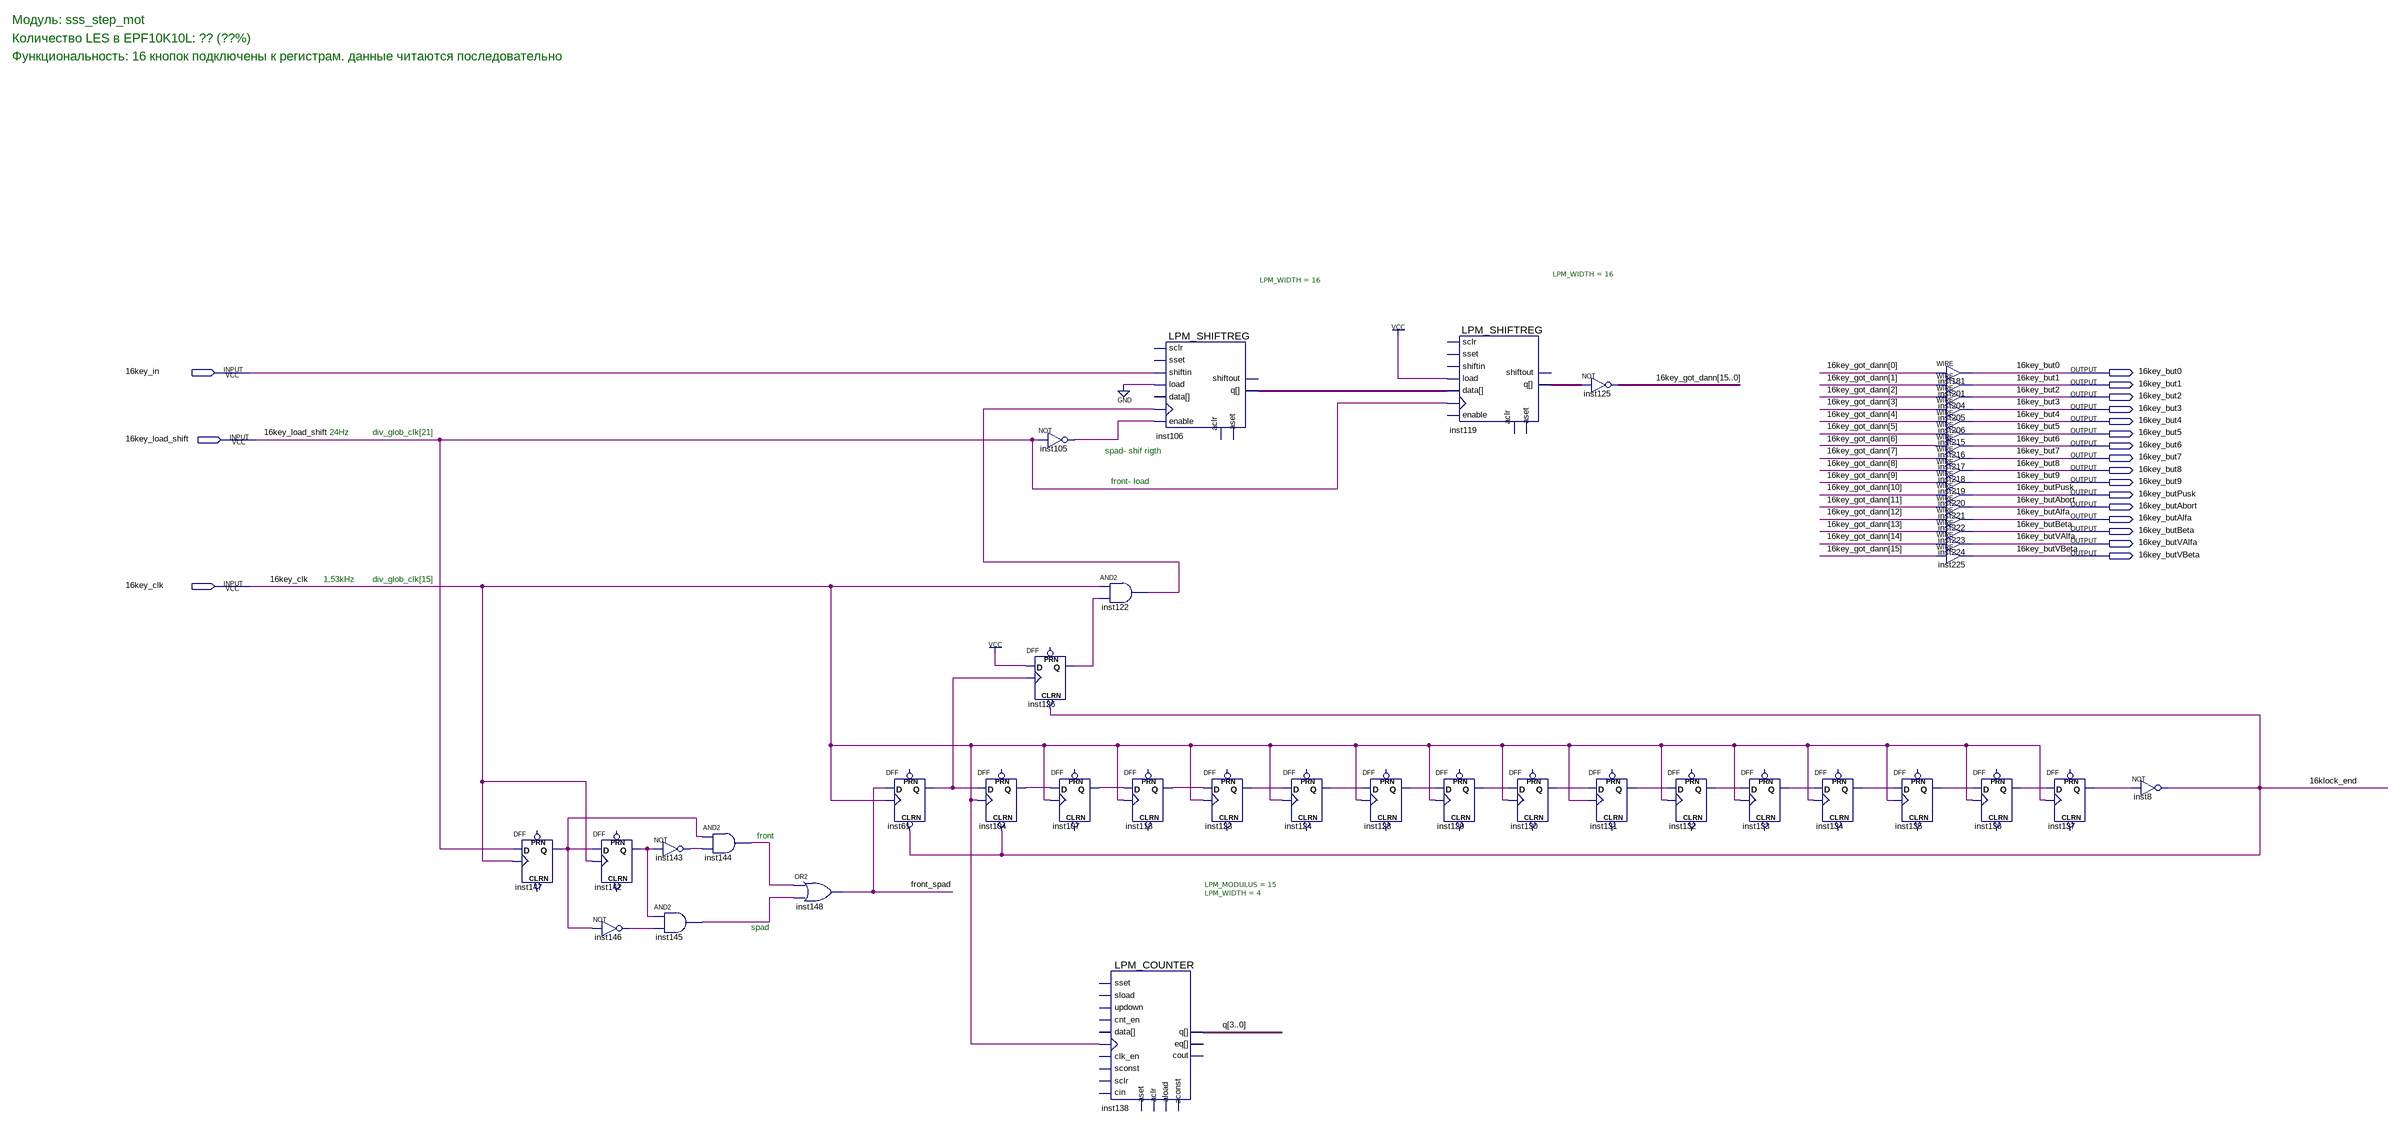
[diagram p0: schematic sheet]
// Quartus schematic sss_16key.bdf as structural Verilog: 47 symbols, 19 pins
module sss_16key (
  input  \16key_in ,
  input  \16key_load_shift ,
  input  \16key_clk ,
  output \16key_but0 ,
  output \16key_but1 ,
  output \16key_but2 ,
  output \16key_but3 ,
  output \16key_but4 ,
  output \16key_but5 ,
  output \16key_but6 ,
  output \16key_but7 ,
  output \16key_but8 ,
  output \16key_but9 ,
  output \16key_butPusk ,
  output \16key_butAbort ,
  output \16key_butAlfa ,
  output \16key_butBeta ,
  output \16key_butVAlfa ,
  output \16key_butVBeta 
);

  wire \16klock_end , front_spad, inst61_q, inst104_q, inst105_out, inst107_q, inst118_q, inst122_out,
       inst123_q, inst124_q, inst126_q, inst128_q, inst129_q, inst130_q, inst131_q, inst132_q, inst133_q,
       inst134_q, inst135_q, inst136_q, inst137_q, inst142_q, inst143_out, inst144_out, inst145_out,
       inst146_out, inst147_q;
  wire [3:0] q;
  wire [15:0] \16key_got_dann , inst106_q, inst119_q;

  DFF inst147 (.CLK(\16key_clk ), .D(\16key_load_shift ), .Q(inst147_q));  // open: CLRN, PRN
  DFF inst142 (.CLK(\16key_clk ), .D(inst147_q), .Q(inst142_q));  // open: CLRN, PRN
  not inst146 (inst146_out, inst147_q);
  not inst143 (inst143_out, inst142_q);
  and inst145 (inst145_out, inst142_q, inst146_out);
  and inst144 (inst144_out, inst147_q, inst143_out);
  or inst148 (front_spad, inst144_out, inst145_out);
  DFF inst61 (.CLRN(\16klock_end ), .CLK(\16key_clk ), .D(front_spad), .Q(inst61_q));  // open: PRN
  DFF inst104 (.CLRN(\16klock_end ), .CLK(\16key_clk ), .D(inst61_q), .Q(inst104_q));  // open: PRN
  not inst105 (inst105_out, \16key_load_shift );
  DFF inst126 (.CLRN(\16klock_end ), .CLK(inst61_q), .D(1'b1), .Q(inst126_q));  // open: PRN
  DFF inst107 (.CLK(\16key_clk ), .D(inst104_q), .Q(inst107_q));  // open: CLRN, PRN
  and inst122 (inst122_out, \16key_clk , inst126_q);
  LPM_COUNTER #(.LPM_MODULUS(15), .LPM_WIDTH(4)) inst138 (
    .clock(\16key_clk ), .q(q));  // open: sset, sload, updown, cnt_en, data, clk_en, sconst, sclr, aload, aclr, aset, aconst, cin, eq, cout
  LPM_SHIFTREG #(.LPM_WIDTH(16)) inst106 (
    .shiftin(\16key_in ), .enable(inst105_out), .clock(inst122_out), .load(1'b0), .q(inst106_q));  // open: sset, data, sclr, aset, aclr, shiftout
  DFF inst118 (.CLK(\16key_clk ), .D(inst107_q), .Q(inst118_q));  // open: CLRN, PRN
  DFF inst123 (.CLK(\16key_clk ), .D(inst118_q), .Q(inst123_q));  // open: CLRN, PRN
  DFF inst124 (.CLK(\16key_clk ), .D(inst123_q), .Q(inst124_q));  // open: CLRN, PRN
  DFF inst128 (.CLK(\16key_clk ), .D(inst124_q), .Q(inst128_q));  // open: CLRN, PRN
  LPM_SHIFTREG #(.LPM_WIDTH(16)) inst119 (
    .clock(\16key_load_shift ), .data(inst106_q), .load(1'b1), .q(inst119_q));  // open: shiftin, sset, enable, sclr, aset, aclr, shiftout
  DFF inst129 (.CLK(\16key_clk ), .D(inst128_q), .Q(inst129_q));  // open: CLRN, PRN
  DFF inst130 (.CLK(\16key_clk ), .D(inst129_q), .Q(inst130_q));  // open: CLRN, PRN
  assign \16key_got_dann  = ~inst119_q;  // NOT inst125, 16 bits wide
  DFF inst131 (.CLK(\16key_clk ), .D(inst130_q), .Q(inst131_q));  // open: CLRN, PRN
  DFF inst132 (.CLK(\16key_clk ), .D(inst131_q), .Q(inst132_q));  // open: CLRN, PRN
  DFF inst133 (.CLK(\16key_clk ), .D(inst132_q), .Q(inst133_q));  // open: CLRN, PRN
  DFF inst134 (.CLK(\16key_clk ), .D(inst133_q), .Q(inst134_q));  // open: CLRN, PRN
  assign \16key_but0  = \16key_got_dann [0];  // WIRE inst181
  assign \16key_but1  = \16key_got_dann [1];  // WIRE inst201
  assign \16key_but2  = \16key_got_dann [2];  // WIRE inst204
  assign \16key_but3  = \16key_got_dann [3];  // WIRE inst205
  assign \16key_but4  = \16key_got_dann [4];  // WIRE inst206
  assign \16key_but5  = \16key_got_dann [5];  // WIRE inst215
  assign \16key_but6  = \16key_got_dann [6];  // WIRE inst216
  assign \16key_but7  = \16key_got_dann [7];  // WIRE inst217
  assign \16key_but8  = \16key_got_dann [8];  // WIRE inst218
  assign \16key_but9  = \16key_got_dann [9];  // WIRE inst219
  assign \16key_butPusk  = \16key_got_dann [10];  // WIRE inst220
  assign \16key_butAbort  = \16key_got_dann [11];  // WIRE inst221
  assign \16key_butAlfa  = \16key_got_dann [12];  // WIRE inst222
  assign \16key_butBeta  = \16key_got_dann [13];  // WIRE inst223
  assign \16key_butVAlfa  = \16key_got_dann [14];  // WIRE inst224
  assign \16key_butVBeta  = \16key_got_dann [15];  // WIRE inst225
  DFF inst135 (.CLK(\16key_clk ), .D(inst134_q), .Q(inst135_q));  // open: CLRN, PRN
  DFF inst136 (.CLK(\16key_clk ), .D(inst135_q), .Q(inst136_q));  // open: CLRN, PRN
  DFF inst137 (.CLK(\16key_clk ), .D(inst136_q), .Q(inst137_q));  // open: CLRN, PRN
  not inst8 (\16klock_end , inst137_q);

  // Notes on the sheet:
  //   Модуль: sss_step_mot
  //   Количество LES в EPF10K10L: ?? (??%)
  //   Функциональность: 16 кнопок подключены к регистрам. данные читаются последовательно
  //   24Hz
  //   div_glob_clk[21]
  //   spad- shif rigth
  //   front- load
  //   1,53kHz
  //   div_glob_clk[15]
  //   front
  //   spad
endmodule
